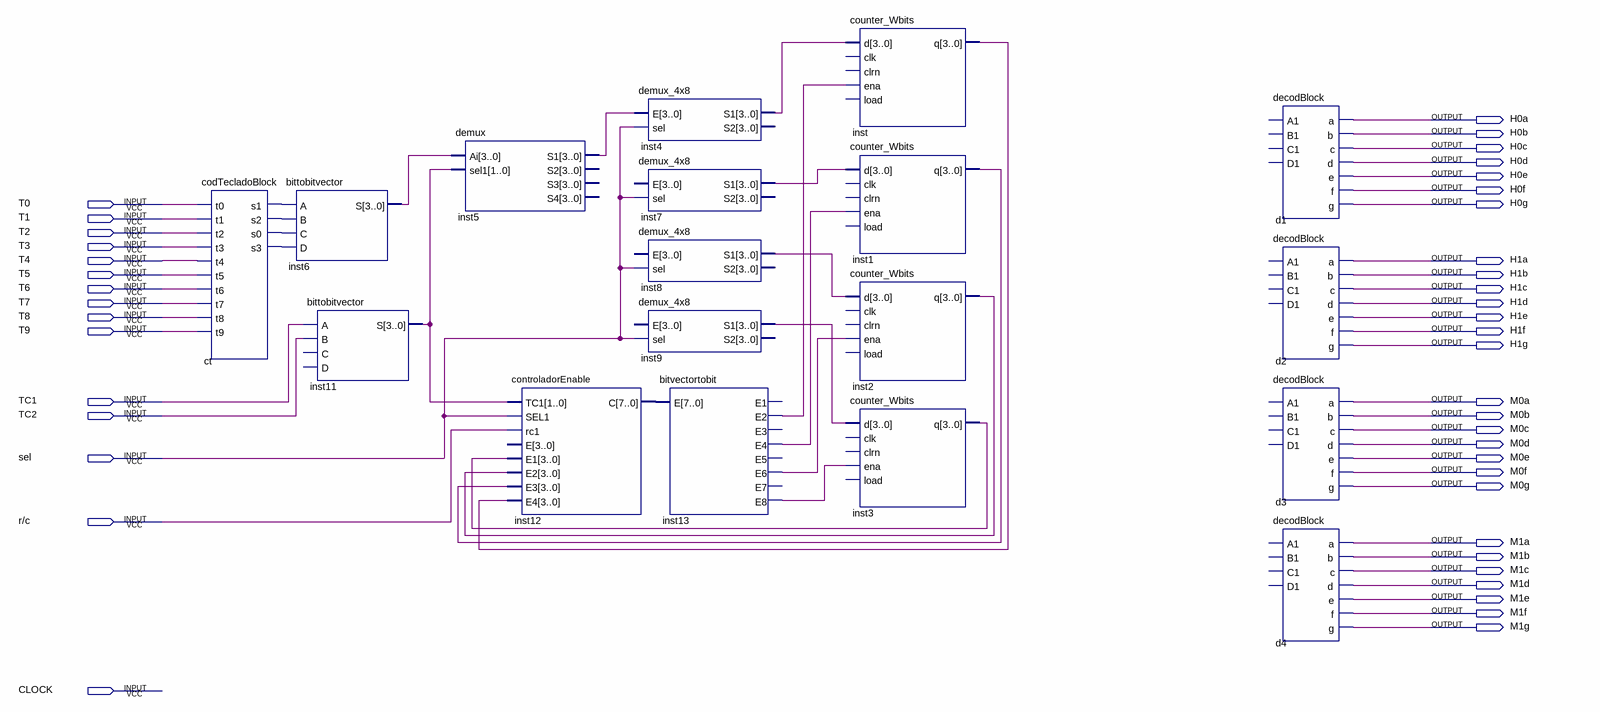
[diagram p0: schematic sheet]
// Quartus schematic relogioBlock.bdf as structural Verilog: 18 symbols, 43 pins
module relogioBlock (
  input  T0,
  input  T1,
  input  T2,
  input  T3,
  input  T4,
  input  T5,
  input  T6,
  input  T7,
  input  T8,
  input  T9,
  input  TC1,
  input  TC2,
  input  sel,
  input  \r/c ,
  input  CLOCK,
  output H0a,
  output H0b,
  output H0c,
  output H0d,
  output H0e,
  output H0f,
  output H0g,
  output H1a,
  output H1b,
  output H1c,
  output H1d,
  output H1e,
  output H1f,
  output H1g,
  output M0a,
  output M0b,
  output M0c,
  output M0d,
  output M0e,
  output M0f,
  output M0g,
  output M1a,
  output M1b,
  output M1c,
  output M1d,
  output M1e,
  output M1f,
  output M1g
);

  wire ct_s0, ct_s1, ct_s2, ct_s3, inst11_s, inst13_e2, inst13_e4, inst13_e6, inst13_e8;
  wire [3:0] inst1_q, inst2_q, inst3_q, inst4_s1, inst5_s1, inst6_s, inst7_s1, inst8_s1, inst9_s1, inst_q;
  wire [7:0] inst12_c;

  codTecladoBlock ct (
    .t0(T0), .t1(T1), .t2(T2), .t3(T3), .t4(T4), .t5(T5), .t6(T6), .t7(T7), .t8(T8), .t9(T9), .s1(ct_s1),
    .s2(ct_s2), .s0(ct_s0), .s3(ct_s3));
  bittobitvector inst6 (.A(ct_s1), .B(ct_s2), .C(ct_s0), .D(ct_s3), .S(inst6_s));
  bittobitvector inst11 (.A(TC1), .B(TC2), .S(inst11_s));  // open: C, D
  demux inst5 (.Ai(inst6_s), .sel1({2{inst11_s}}), .S1(inst5_s1));  // open: S2, S3, S4
  controladorEnable inst12 (
    .TC1({2{inst11_s}}), .SEL1(sel), .rc1(\r/c ), .E1(inst3_q), .E2(inst2_q), .E3(inst1_q), .E4(inst_q),
    .C(inst12_c));  // open: E
  demux_4x8 inst4 (.E(inst5_s1), .sel(sel), .S1(inst4_s1));  // open: S2
  demux_4x8 inst7 (.sel(sel), .S1(inst7_s1));  // open: E, S2
  demux_4x8 inst8 (.sel(sel), .S1(inst8_s1));  // open: E, S2
  demux_4x8 inst9 (.sel(sel), .S1(inst9_s1));  // open: E, S2
  bitvectortobit inst13 (
    .E(inst12_c), .E2(inst13_e2), .E4(inst13_e4), .E6(inst13_e6), .E8(inst13_e8));  // open: E1, E3, E5, E7
  counter_Wbits inst (.d(inst4_s1), .ena(inst13_e2), .q(inst_q));  // open: clk, clrn, load
  counter_Wbits inst1 (.d(inst7_s1), .ena(inst13_e4), .q(inst1_q));  // open: clk, clrn, load
  counter_Wbits inst2 (.d(inst8_s1), .ena(inst13_e6), .q(inst2_q));  // open: clk, clrn, load
  counter_Wbits inst3 (.d(inst9_s1), .ena(inst13_e8), .q(inst3_q));  // open: clk, clrn, load
  decodBlock d1 (.a(H0a), .b(H0b), .c(H0c), .d(H0d), .e(H0e), .f(H0f), .g(H0g));  // open: A1, B1, C1, D1
  decodBlock d2 (.a(H1a), .b(H1b), .c(H1c), .d(H1d), .e(H1e), .f(H1f), .g(H1g));  // open: A1, B1, C1, D1
  decodBlock d3 (.a(M0a), .b(M0b), .c(M0c), .d(M0d), .e(M0e), .f(M0f), .g(M0g));  // open: A1, B1, C1, D1
  decodBlock d4 (.a(M1a), .b(M1b), .c(M1c), .d(M1d), .e(M1e), .f(M1f), .g(M1g));  // open: A1, B1, C1, D1
endmodule
